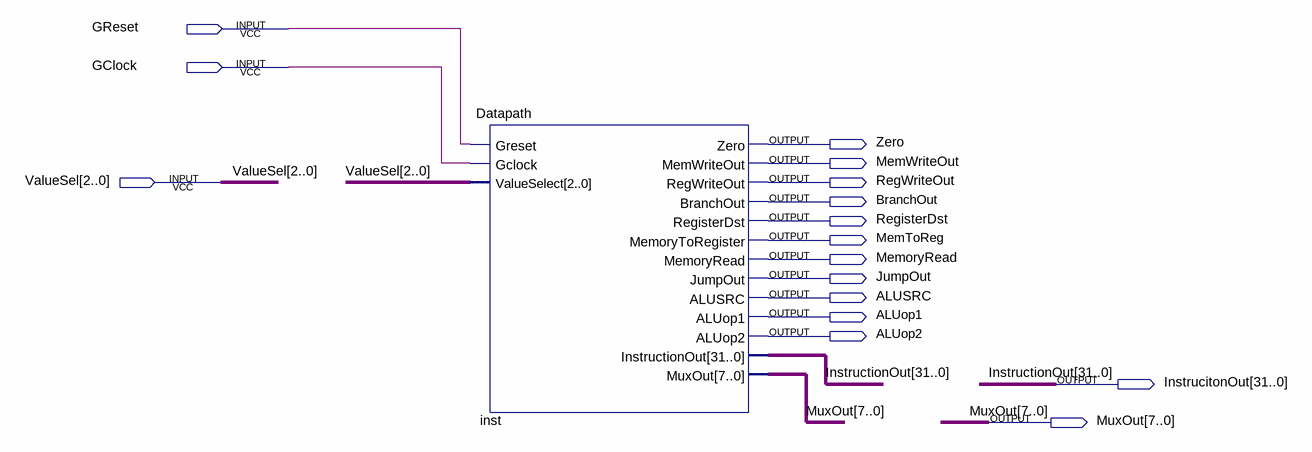
[diagram p0: schematic sheet]
// Quartus schematic Single_cycle_RISC_Block.bdf as structural Verilog: 1 symbols, 16 pins
module Single_cycle_RISC_Block (
  input  GReset,
  input  GClock,
  input  [2:0] ValueSel,
  output Zero,
  output MemWriteOut,
  output RegWriteOut,
  output BranchOut,
  output RegisterDst,
  output MemToReg,
  output MemoryRead,
  output JumpOut,
  output ALUSRC,
  output ALUop1,
  output ALUop2,
  output [31:0] InstrucitonOut,
  output [7:0] MuxOut
);

  Datapath inst (
    .Greset(GReset), .Gclock(GClock), .ValueSelect(ValueSel), .Zero(Zero), .MemWriteOut(MemWriteOut),
    .RegWriteOut(RegWriteOut), .BranchOut(BranchOut), .RegisterDst(RegisterDst), .MemoryToRegister(MemToReg),
    .MemoryRead(MemoryRead), .JumpOut(JumpOut), .ALUSRC(ALUSRC), .ALUop1(ALUop1), .ALUop2(ALUop2),
    .InstructionOut(InstrucitonOut), .MuxOut(MuxOut));

  // Other names for the same wires on the sheet: InstructionOut[31:0] = InstrucitonOut
endmodule
